# Altium schematic sheet 5vOutputs.SchDoc: 5V Outputs
size A; DrawnBy: Andrew Pobrica; DocumentNumber: 5; SheetNumber: 5; SheetTotal: 7
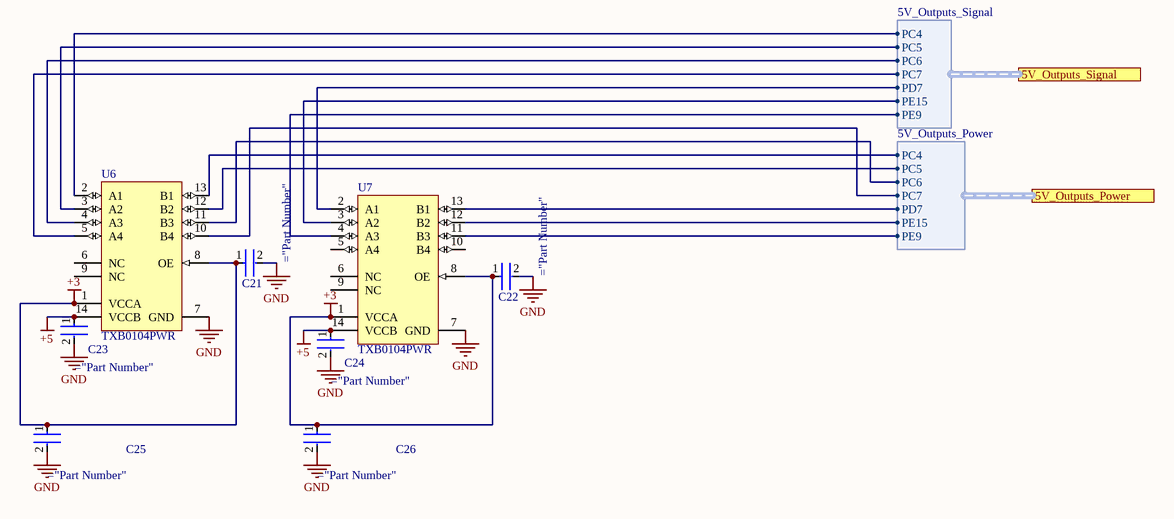
[diagram p0: 5vOutputs.SchDoc]

## Parts
C21  C0603C104K5RACTU  [Kemet_C0805_IPC_A]  (value not drawn)
C22  C0603C104K5RACTU  [Kemet_C0805_IPC_A]  (value not drawn)
C23  C0603C104K5RACTU  [Kemet_C0805_IPC_A]  (value not drawn)
C24  C0603C104K5RACTU  [Kemet_C0805_IPC_A]  (value not drawn)
C25  C0603C104K5RACTU  [Kemet_C0805_IPC_A]  (value not drawn)
C26  C0603C104K5RACTU  [Kemet_C0805_IPC_A]  (value not drawn)
U6  TXB0104PWR  [PW0014A_Custom]
U7  TXB0104PWR  [PW0014A_Custom]

## Ports
5V_Outputs_Power (harness 5V_Outputs_Power), 5V_Outputs_Signal (harness 5V_Outputs_Signal)

## Harnesses
5V_Outputs_Signal: PC4, PC5, PC6, PC7, PD7, PE15, PE9
5V_Outputs_Power: PC4, PC5, PC6, PC7, PD7, PE15, PE9

## Nets
+3: C21.1 C22.1 C25.1 C26.1 U6.1(VCCA) U6.8(OE) U7.1(VCCA) U7.8(OE)
+5: C23.1 C24.1 U6.14(VCCB) U7.14(VCCB)
GND: C21.2 C22.2 C23.2 C24.2 C25.2 C26.2 U6.7(GND) U7.7(GND)
NetU6_2: U6.2(A1) ; port 5V_Outputs_Signal.PC4
NetU6_3: U6.3(A2) ; port 5V_Outputs_Signal.PC5
NetU6_4: U6.4(A3) ; port 5V_Outputs_Signal.PC6
NetU6_5: U6.5(A4) ; port 5V_Outputs_Signal.PC7
NetU6_10: U6.10(B4) ; port 5V_Outputs_Power.PC7
NetU6_11: U6.11(B3) ; port 5V_Outputs_Power.PC6
NetU6_12: U6.12(B2) ; port 5V_Outputs_Power.PC5
NetU6_13: U6.13(B1) ; port 5V_Outputs_Power.PC4
NetU7_2: U7.2(A1) ; port 5V_Outputs_Signal.PD7
NetU7_3: U7.3(A2) ; port 5V_Outputs_Signal.PE15
NetU7_4: U7.4(A3) ; port 5V_Outputs_Signal.PE9
NetU7_11: U7.11(B3) ; port 5V_Outputs_Power.PE9
NetU7_12: U7.12(B2) ; port 5V_Outputs_Power.PE15
NetU7_13: U7.13(B1) ; port 5V_Outputs_Power.PD7

Not connected (* = marked no-connect by the designer): U6 6(NC) 9(NC); U7 5(A4) 6(NC) 9(NC) 10(B4)

## Library data of the parts
U6 U7 = TI-TXB0104-TSSOP_PW-14: 4-Bit Bidirectional Voltage-Level Translator with Automatic Direction Sensing and +/- 15-kV ESD Protection, -40 to 85 degC, 14-Pin TSSOP (PW), Green (RoHS & Sb/Br), Tape and Reel; Manufacturer: Texas Instruments; Dynamic Catalog: TXBSeries; Number of Bits: 4; Voltage - Supply: 1.2V~3.6V,1.65V~5.5V; Other Names: 296-21929-6; Propagation Delay (Max): 4ns; Logic Function: Translator,Bidirectional; Data Rate: 100Mbps; Differential - Input: Output:No/No; Number of Outputs/Channel: 1; Output Type: Logic; Product Training Modules: VoltageLevelTranslation; Number of Channels: 4; Package Reference: PW14; Package Description: 14-Pin Thin Shrink Small Outline Package, Body 5 x 4.4 mm, Pitch 0.65 mm; Datasheet Version: Rev. G, 11/2014; Manufacturer URL: http://www.ti.com/; Series: -; Packaging: Digi-Reel®; Mounting Technology: SurfaceMount; Family: Logic-Translators; Standard Package: 1; Category: IntegratedCircuits(ICs); Supplier Device Package: 14-TSSOP; Datasheet URL: http://www.ti.com/general/docs/lit/getliterature.tsp?genericPartNumber=TXB0104&fileType=pdf; Operating Temperature: -40°C~85°C; Input Type: Logic; Package / Case: 14-TSSOP(0.173",4.40mmWidth)